# EAGLE design TPS63031 breakout (EAGLE 8.5.0)
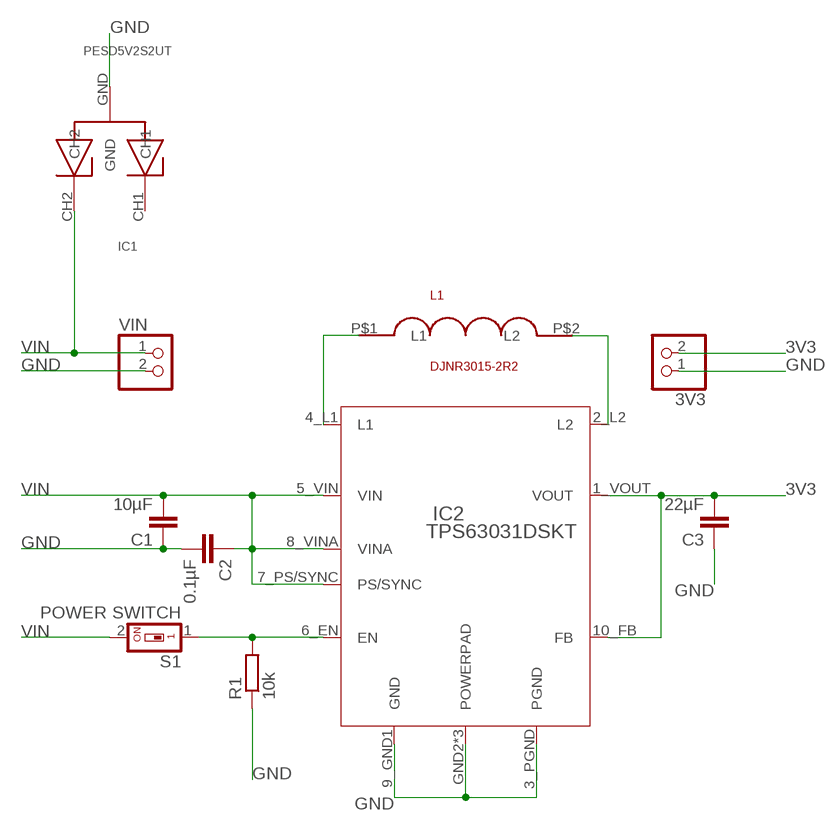
[diagram p0: schematic, sheet 1]

## Parts
3V3  PINHD-1X2  [1X02]
C1  10µF  C-EUC0805  [C0805]
C2  0.1µF  C-EUC0805  [C0805]
C3  22µF  C-EUC0805  [C0805]
IC1  PESD5V2S2UT  PESDXS2UT  [SOT-23]
IC2  TPS63031DSKT  [SMT]
L1  DJNR3015-2R2  DJNR3015-1R5  [FFF]
R1  10k  R-EU_R0805  [R0805]
S1  POWER SWITCH  SWS001  [SMS-001]
VIN  PINHD-1X2  [1X02]

## Nets
3V3: 3V3.2 C3.2 IC2.1_VOUT(VOUT) IC2.10_FB(FB)
GND: 3V3.1 C1.1 C2.2 C3.1 IC1.GND IC2.3_PGND(PGND) IC2.9_GND1(GND) IC2.GND2(POWERPAD) IC2.GND3(POWERPAD) IC2.GND4(POWERPAD) R1.1 VIN.2
L1: IC2.4_L1(L1) L1.P$1(L1)
L2: IC2.2_L2(L2) L1.P$2(L2)
N$3: IC2.6_EN(EN) R1.2 S1.1
VIN: C1.2 C2.1 IC1.CH2 IC2.5_VIN(VIN) IC2.7_PS/SYNC(PS/SYNC) IC2.8_VINA(VINA) S1.2 VIN.1
Unconnected: IC1.CH1

## Library data of the parts
3V3 VIN = pinhead:PINHD-1X2: PIN HEADER
C1-C3 = rcl:C-EU: CAPACITOR, European symbol
IC1 = PESDxS2UT:PESDXS2UT
IC2 = TPS63031 - Buck Boost Voltage Regulator:TPS63031DSKT
L1 = DJNR3015-1R5 Inductor:DJNR3015-1R5
R1 = resistor:R-EU_: RESISTOR, European symbol
S1 = smd-special:SWS001: SMD Dip Switch 1 pol.

## Board
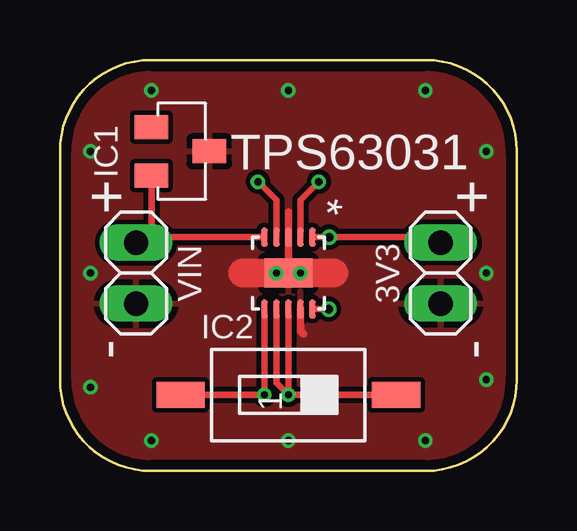
[diagram p1: board, top side]
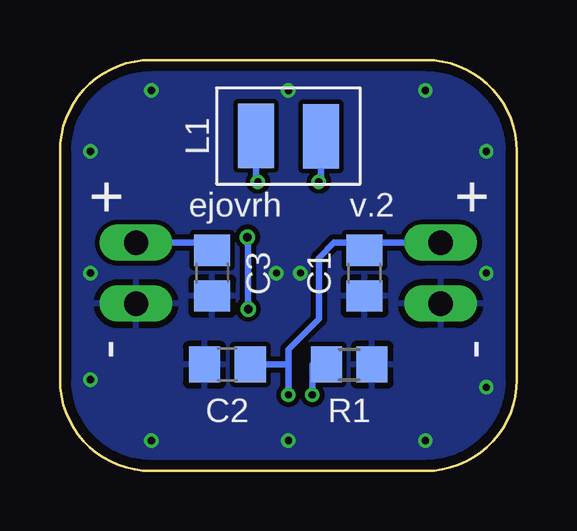
[diagram p2: board, bottom side, seen from below]

Size 19.05 x 17.14 mm. Coordinates in mm from the lower left corner, seen from the top.
Outline: 3.81,17.14 15.24,17.14 arc-90 19.05,13.34 19.05,3.81 arc-90 15.24,0 3.81,0 arc-90 0,3.81 0,13.34 arc-90 3.81,17.14
Copper layers (1*16): Top 0.035mm / dielectric 1.5mm / Bottom 0.035mm
Design rules "markovac_2layer": minimum track width 0.2mm, minimum drill 0.3mm, track to track 0.2mm, track to pad 0.2mm, pad to pad 0.2mm, via to via 0.2mm, smd to smd 0.2mm, copper to edge 16mil, drill to drill 8mil, minimum pad ring 0.15mm, minimum via ring 0.15mm, stop-mask expansion 4mil, vias tented up to drill 25mil, thermal gap 10mil

### Footprints (pad centres in the part's own frame; a part is rotated, then mirrored left to right if it is on the bottom)
1X02 = drill 1.016 long: 1 -1.27,0; 2 1.27,0
C0805 = smd 1.3 x 1.5: 1 -0.95,0; 2 0.95,0
SOT-23 = smd 1 x 1.4: CH1 -1.016,-1.262; CH2 1.016,-1.262; GND 0,1.151
SMT = smd 0.8 x 0.28: 1_VOUT -1.5,1; 2_L2 -1.5,0.5; 3_PGND -1.5,0; 4_L1 -1.5,-0.5; 5_VIN -1.5,-1; 6_EN 1.5,-1; 7_PS/SYNC 1.5,-0.5; 8_VINA 1.5,0; 9_GND1 1.5,0.5; 10_FB 1.5,1 | smd 1.2 x 2: GND2 0,0 | drill 0.3 pad 0.61: GND3 0,0.5; GND4 0,-0.5
FFF = smd 1.5 x 2.7: P$1 1.35,-0.01; P$2 -1.35,0.01
R0805 = smd 1.3 x 1.5: 1 -0.95,0; 2 0.95,0
SMS-001 = smd 1.092 x 2.007: 1 0,-4.496; 2 0,4.496

### Placement (x,y rotation side)
3V3  15.88,8.26 90 top
C1  6.35,8.26 90 bottom
C2  12.07,4.45 180 bottom
C3  12.7,8.26 90 bottom
IC1  5.08,13.34 270 top
IC2  9.53,8.26 270 top
L1  9.53,13.97 0 bottom
R1  6.98,4.45 180 bottom
S1  9.53,3.18 270 top
VIN  3.18,8.26 270 top

### Tracks (layer width: path | path; a pad name or v marks a point on that pad's centre or on a via)
3V3  (via drill 0.35)
  Top 0.279: 3V3.2 15.64,9.76 v11.23,9.76 IC2.1_VOUT | IC2.10_FB v11.2,6.76
  Bottom 0.279: 3V3.2 13.02,9.53 C3.2 | v11.2,6.76 11.2,9.72 v11.23,9.76
GND  (via drill 0.3)
  Top 0.305: 9.53,10.8 IC2.3_PGND 9.53,8.89 | IC2.9_GND1 10.03,5.85 10.16,5.71
  Top 1.194: 7.62,8.26 IC2.GND2 11.43,8.26
  other vias: 3.81,15.88 15.24,15.88 17.78,13.34 17.78,3.81 15.24,1.27 3.81,1.27 1.27,3.49 1.27,13.34 9.53,15.88 9.53,1.27 1.27,8.26 17.78,8.26
  pour Bottom: 0,17.14 19.05,17.14 19.05,0 0,0
  pour Top: 0,17.14 19.05,17.14 19.05,0 0,0
L1  (via drill 0.3)
  Top 0.279: IC2.4_L1 9.03,11.3 v8.26,12.07
  Bottom 0.279: v8.26,12.07 8.18,12.07 L1.P$1
L2  (via drill 0.3)
  Top 0.279: IC2.2_L2 10.03,11.3 v10.8,12.07
  Bottom 0.279: v10.8,12.07 10.88,12.07 L1.P$2
N$3  (via drill 0.3)
  Top 0.279: IC2.6_EN v8.53,3.18 S1.1
  Bottom 0.279: R1.2 8.53,4.45 v8.53,3.18
VIN  (via drill 0.3)
  Top 0.279: S1.2 v9.53,3.18 | v9.53,3.18 IC2.8_VINA | 3.81,9.76 IC2.5_VIN | 3.81,9.76 3.4,9.76 VIN.1 | IC1.CH2 3.82,9.76 3.81,9.76 | v9.53,3.18 9.03,3.68 IC2.7_PS/SYNC
  Bottom 0.279: VIN.1 6.03,9.53 6.19,9.37 | 6.19,9.37 C1.2 6.67,8.89 | v9.53,3.18 9.53,4.45 | C2.1 9.53,4.45 | 9.53,4.45 9.53,5.08 8.26,6.35 8.26,8.89 7.62,9.53 6.19,9.53 6.19,9.37

### Text on the board
tPlace: TPS63031 | + | + | - | -
bPlace: + | v.2 | ejovrh | + | - | -